# EAGLE design untitled (EAGLE 9.6.2)
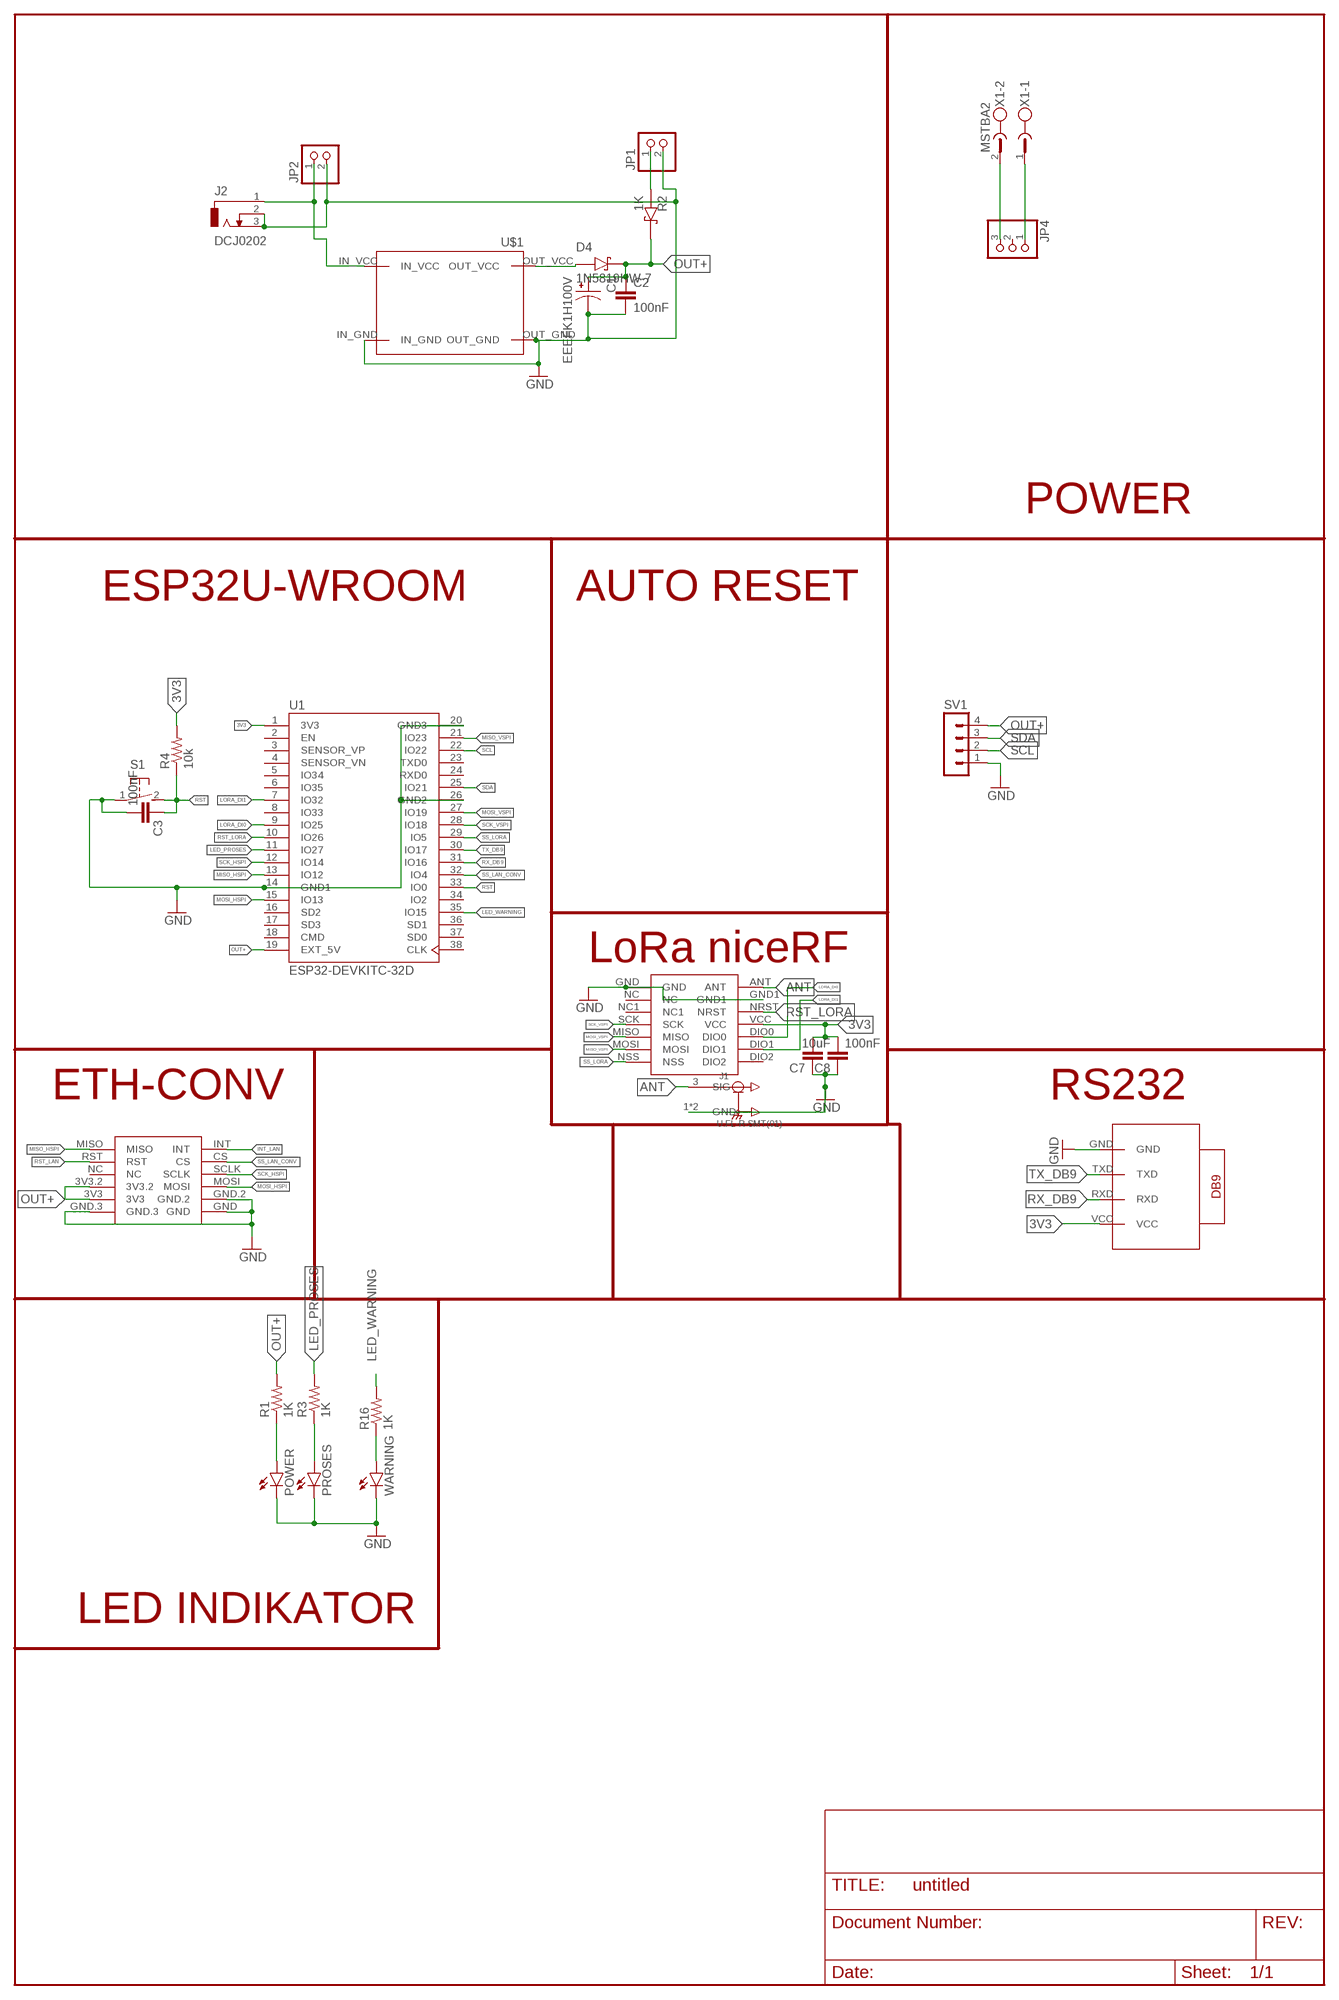
[diagram p0: schematic, sheet 1]

## Parts
C1  EEEFK1H100V  [CAP_EEEFK1H100V]
C2  100nF  C-EUC0805K  [C0805K]
C3  100nF  C-EUC0805K  [C0805K]
C7  10uF  C-EUC0805K  [C0805K]
C8  100nF  C-EUC0805K  [C0805K]
D4  1N5819HW-7  [SOD3715X145N]
J1  U.FL-R-SMT(01)  [HRS_U.FL-R-SMT(01)]
J2  DCJ0202  [DCJ0202]
JP1  PINHD-1X2  [1X02]
JP2  PINHD-1X2  [1X02]
JP4  PINHD-1X3  [1X03]
LORA-NICERF-V1  LORA-NICERF-V2  [LORA-NICERF-V2]
POWER  TLLR4400  [LED3MM]
PROSES  TLLR4400  [LED3MM]
R1  1K  R-US_M0805  [M0805]
R2  1K  1N5819HW-7  [SOD3715X145N]
R3  1K  R-US_M0805  [M0805]
R4  10k  R-US_M0805  [M0805]
R16  1K  R-US_M0805  [M0805]
S1  31-XX  [B3F-31XX]
SV1  MA04-1  [MA04-1]
U1  ESP32-DEVKITC-32D  [MODULE_ESP32-DEVKITC-32D]
U$1  STEPDOWN_SY8205  [STEPDOWN_SY8205]
U$3  MINI_W5500  [MINI_W5500]
U$5  RS232-BREAKOUTBREAKOUT  [RS232-BREAKOUT]
WARNING  TLLR4400  [LED3MM]
X1  MSTBA2  [MSTBA2]

## Nets
3V3: C7.2 C8.2 LORA-NICERF-V1.VCC R4.2 U1.1(3V3) U$5.VCC
ANT: J1.3(SIG) LORA-NICERF-V1.ANT
GND: C1.2 C2.2 C3.2 C7.1 C8.1 J1.1(GND) J1.2(GND) J2.2 J2.3 JP1.2 JP2.2 LORA-NICERF-V1.GND LORA-NICERF-V1.GND1 POWER.K(C) PROSES.K(C) S1.1(P) SV1.1 U1.14(GND1) U1.20(GND3) U1.26(GND2) U$1.IN_GND U$1.OUT_GND U$3.GND U$3.GND.2 U$3.GND.3 U$5.GND WARNING.K(C)
INT_LAN: U$3.INT
LED_PROSES: R3.2 U1.11(IO27)
LED_WARNING: R16.2 U1.35(IO15)
LORA_DI0: LORA-NICERF-V1.DIO0 U1.9(IO25)
LORA_DI1: LORA-NICERF-V1.DIO1 U1.7(IO32)
MISO_HSPI: U1.13(IO12) U$3.MISO
MISO_VSPI: LORA-NICERF-V1.MOSI U1.21(IO23)
MOSI_HSPI: U1.15(IO13) U$3.MOSI
MOSI_VSPI: LORA-NICERF-V1.MISO U1.27(IO19)
N$1: POWER.A R1.1
N$3: PROSES.A R3.1
N$4: J2.1 JP2.1 U$1.IN_VCC
N$5: JP4.3 X1.2
N$6: D4.A U$1.OUT_VCC
N$7: JP1.1 R2.A
N$8: JP4.1 X1.1
N$16: R16.1 WARNING.A
OUT+: C1.1 C2.1 D4.C(K) R1.2 R2.C(K) SV1.4 U1.19(EXT_5V) U$3.3V3 U$3.3V3.2
RST: C3.1 R4.1 S1.2(S) U1.33(IO0)
RST_LAN: U$3.RST
RST_LORA: LORA-NICERF-V1.NRST U1.10(IO26)
RX_DB9: U1.31(IO16) U$5.RXD
SCK_HSPI: U1.12(IO14) U$3.SCLK
SCK_VSPI: LORA-NICERF-V1.SCK U1.28(IO18)
SCL: SV1.2 U1.22(IO22)
SDA: SV1.3 U1.25(IO21)
SS_LAN_CONV: U1.32(IO4) U$3.CS
SS_LORA: LORA-NICERF-V1.NSS U1.29(IO5)
TX_DB9: U1.30(IO17) U$5.TXD
Unconnected: JP4.2 LORA-NICERF-V1.DIO2 LORA-NICERF-V1.NC LORA-NICERF-V1.NC1 U1.2(EN) U1.3(SENSOR_VP) U1.4(SENSOR_VN) U1.5(IO34) U1.6(IO35) U1.8(IO33) U1.16(SD2) U1.17(SD3) U1.18(CMD) U1.23(TXD0) U1.24(RXD0) U1.34(IO2) U1.36(SD1) U1.37(SD0) U1.38(CLK) U$3.NC

## Notes on the sheet
- POWER
- ESP32U-WROOM | AUTO RESET
- LoRa niceRF
- ETH-CONV | RS232
- LED INDIKATOR

## Library data of the parts
C1 = EEEFK1H100V:EEEFK1H100V: Check availability <https://pricing.snapeda.com/parts/EEEFK1H100V/Panasonic/view-part?ref=eda>; AVAILABILITY: In Stock; DESCRIPTION: CAP ALUM 10UF 20% 50V SMD; MF: Panasonic; MP: EEEFK1H100V; PACKAGE: RADIAL-2 Panasonic; PRICE: None; PURCHASE-URL: https://pricing.snapeda.com/search/part/EEEFK1H100V/?ref=eda
C2 C3 C7 C8 = rcl:C-EU: CAPACITOR, European symbol; SPICEPREFIX: C
D4 R2 = 1N5819HW-7:1N5819HW-7: 1N5819HW Series 40 V 1 A Surface Mount Schottky Barrier Rectifier - SOD-123 Check availability <https://pricing.snapeda.com/parts/1N5819HW-7/Diodes%20Inc./view-part?ref=eda>; AVAILABILITY: In Stock; DESCRIPTION: Diode Schottky 40 V 1A Surface Mount SOD-123; MF: Diodes Inc.; MP: 1N5819HW-7; PACKAGE: SOD-123 Fairchild Semiconductor; PRICE: None; PURCHASE-URL: https://pricing.snapeda.com/search/part/1N5819HW-7/?ref=eda
J1 = U.FL-R-SMT_01_:U.FL-R-SMT(01): U.FL Series 6 Ghz 50 Ohm Ultra-small SMT Coaxial Cable Receptacle Check availability <https://pricing.snapeda.com/parts/U.FL-R-SMT%2801%29/Hirose/view-part?ref=eda>; AVAILABILITY: In Stock; DESCRIPTION: U.FL (UMCC) Connector Receptacle, Male Pin 50Ohm Surface Mount Solder. RF Connectors / Coaxial Connectors; MF: Hirose; MP: U.FL-R-SMT(01); PACKAGE: None; PRICE: None; PURCHASE-URL: https://pricing.snapeda.com/search/part/U.FL-R-SMT(01)/?ref=eda
J2 = con-jack:DCJ0202: DC POWER JACK Source: DCJ0202.pdf; OC_FARNELL: unknown; OC_NEWARK: unknown
JP1 JP2 = pinhead:PINHD-1X2: PIN HEADER
JP4 = pinhead:PINHD-1X3: PIN HEADER
LORA-NICERF-V1 = LORA-NICERF-V2:LORA-NICERF-V2
POWER PROSES WARNING = led:TLLR4400: Low Current (2mA) LED 3 mm Tinted Diffused Package color RED Source: Data sheet <http://www.farnell.com/datasheets/391100.pdf>; MF: VISHAY SEMICONDUCTOR; OC_FARNELL: 1612437
R1 R3 R4 R16 = adafruit:R-US_: RESISTOR, American symbol
S1 = switch-omron:31-XX: OMRON SWITCH; MPN: B3F-3100; OC_FARNELL: 959704; OC_NEWARK: 36M3582
SV1 = con-lstb:MA04-1: PIN HEADER; OC_FARNELL: unknown; OC_NEWARK: unknown
U1 = ESP32-DEVKITC-32D:ESP32-DEVKITC-32D: Eval Board For Esp-Wroom-32 Check availability <https://pricing.snapeda.com/parts/ESP32-DEVKITC-32D/Espressif%20Systems/view-part?ref=eda>; AVAILABILITY: In Stock; DESCRIPTION: WiFi Development Tools (802.11) ESP32 General Development Kit, ESP32-WROOM-32D on the board; MF: Espressif Systems; MP: ESP32-DEVKITC-32D; PACKAGE: None; PRICE: None; PURCHASE-URL: https://pricing.snapeda.com/search/part/ESP32-DEVKITC-32D/?ref=eda
U$1 = STEPDOWN_SY8205:STEPDOWN_SY8205
U$3 = ethernet-mikroavr:MINI_W5500: MINI ETHERNET W5500, CREATE BY MIKROAVR.COM
U$5 = RS232-BREAKOUT:RS232-BREAKOUT
X1 = con-phoenix-508:MSTBA2: PHOENIX; MF: FARNELL; MPN: 1757242; OC_FARNELL: 3705171; OC_NEWARK: 71C4161

## Net classes
0 default: clearance 0.1 mm

## Board
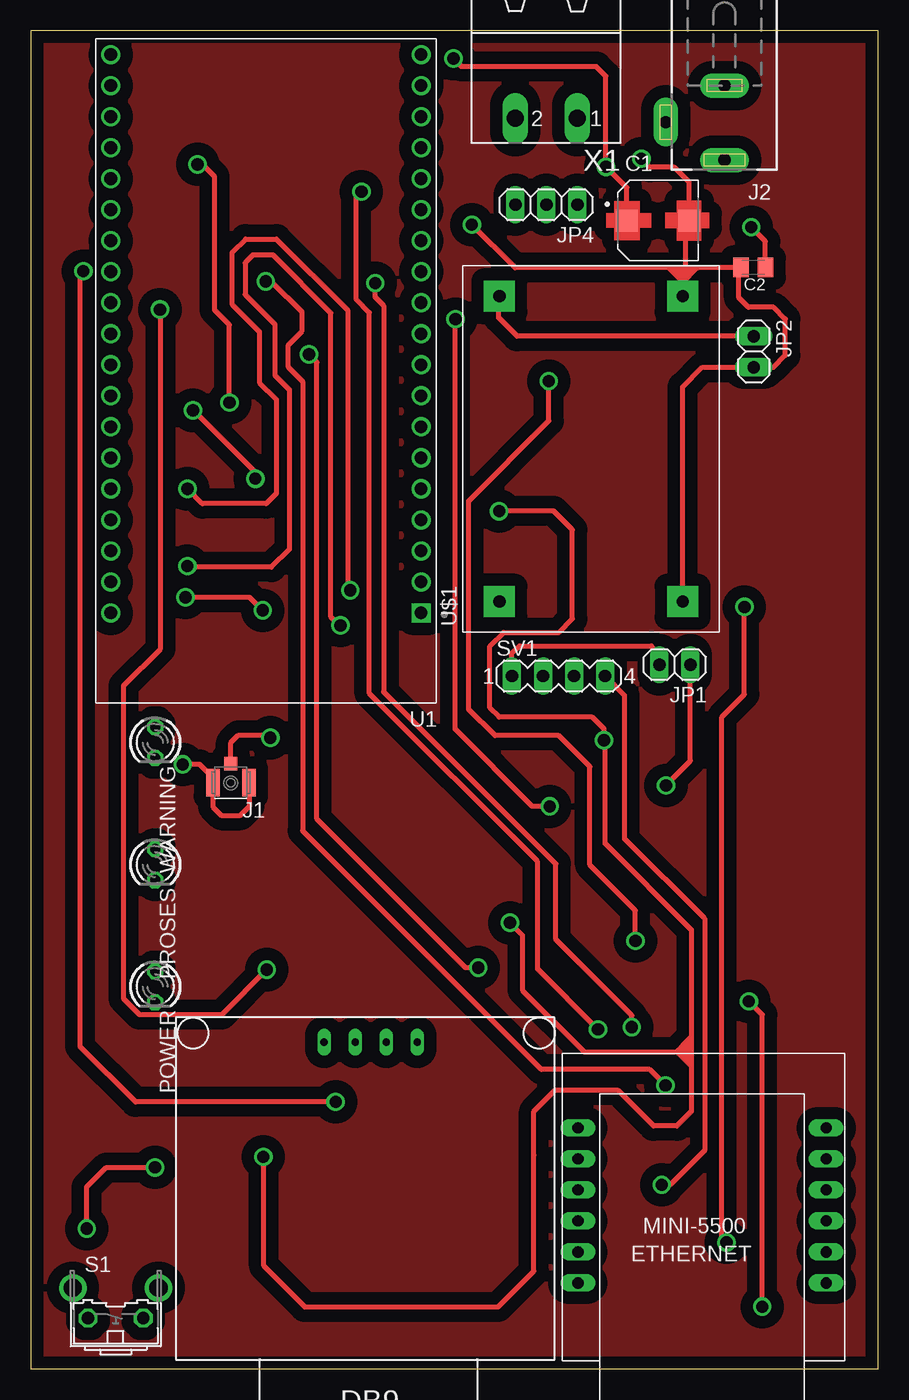
[diagram p1: board, top side]
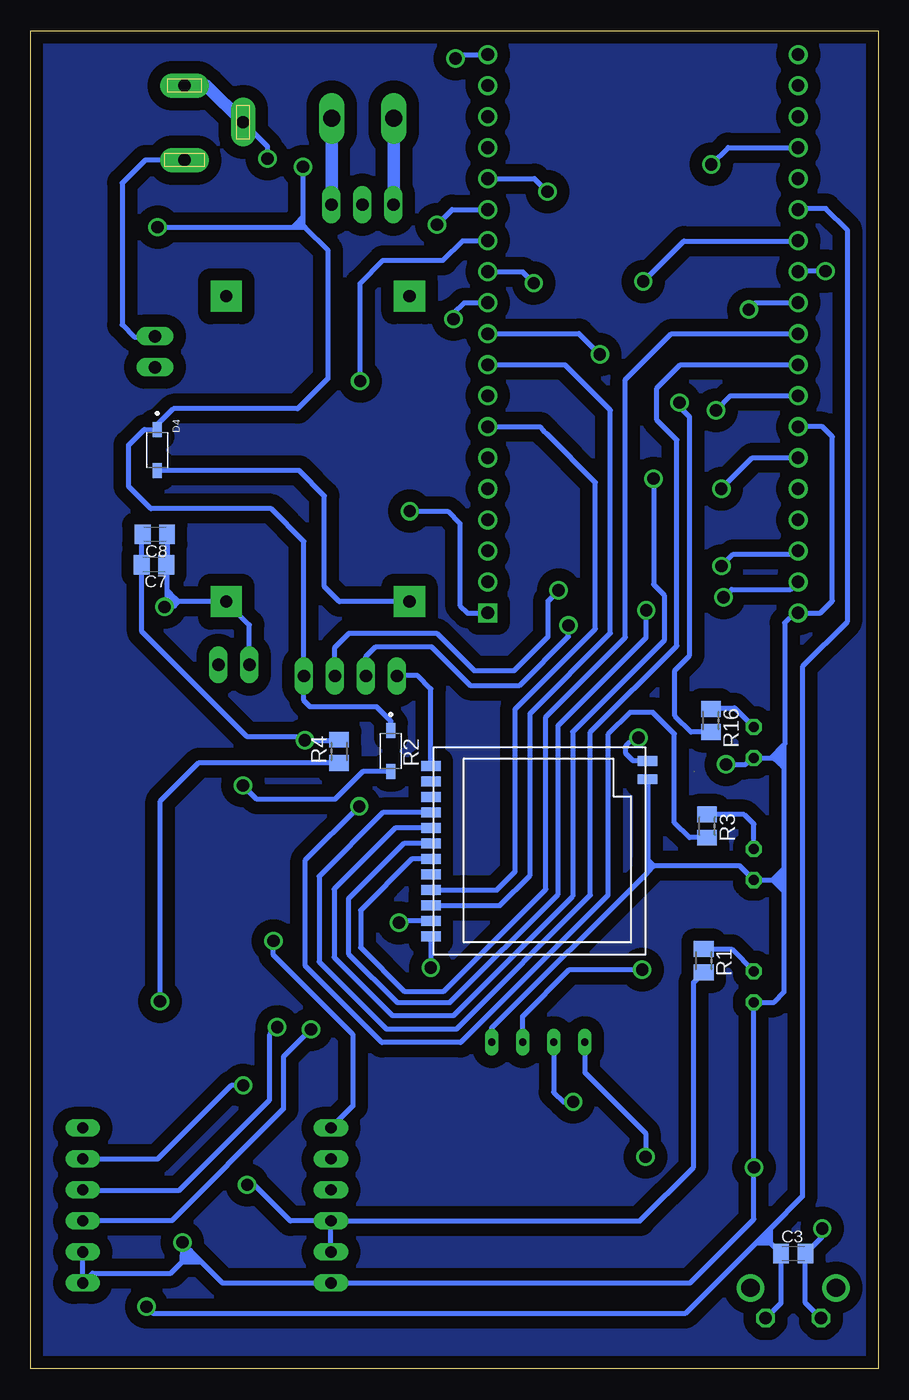
[diagram p2: board, bottom side, seen from below]

Size 69.4 x 109.6 mm. Coordinates in mm from the lower left corner, seen from the top.
Outline: 0,0 69.4,0 69.4,109.6 0,109.6 0,0
Copper layers (1*16): Top 0.035mm / dielectric 1.5mm / Bottom 0.035mm
Design rules "default": minimum track width 6mil, minimum drill 0.35mm, track to track 6mil, track to pad 6mil, pad to pad 6mil, via to via 6mil, smd to smd 6mil, copper to edge 40mil, drill to drill 6mil, minimum pad ring 10mil, minimum via ring 8mil, stop-mask expansion 4mil, vias tented up to drill 0mil, thermal gap 10mil

### Footprints (pad centres in the part's own frame; a part is rotated, then mirrored left to right if it is on the bottom)
CAP_EEEFK1H100V = smd 1.8 x 1.8: 1 -2.55,0; 2 2.55,0
C0805K = smd 1.3 x 1.6: 1 -1,0; 2 1,0
SOD3715X145N = smd 1.21 x 0.73: A 1.68,0; C -1.68,0
HRS_U.FL-R-SMT(01) = smd 1.1 x 2.25: 1 -1.475,0; 2 1.475,0 | smd 1.05 x 1.1: 3 0,-1.55
DCJ0202 = drill 1 pad 2 long: 1 0,3.1; 2 4.8,0; 3 0,-3
1X02 = drill 1.016 long: 1 -1.27,0; 2 1.27,0
1X03 = drill 1.016 long: 1 -2.54,0; 2 0,0; 3 2.54,0
LORA-NICERF-V2 = smd 1.6 x 0.8: ANT 9.17,6.81; DIO0 -8.57,-5.03; DIO1 -8.57,-3.76; DIO2 -8.57,-2.49; GND -8.57,6.4; GND1 9.17,5.31; MISO -8.57,1.32; MOSI -8.57,0.05; NC -8.57,5.13; NC1 -8.57,3.86; NRST -8.57,-7.57; NSS -8.57,-1.22; SCK -8.57,2.59; VCC -8.57,-6.3
LED3MM = drill 0.813 octagon: A -1.27,0; K 1.27,0
M0805 = smd 1.3 x 1.6: 1 -0.95,0; 2 0.95,0
B3F-31XX = drill 1.016 octagon: 1 -2.261,-1.245; 2 2.261,-1.245 | drill 1.499 pad 2.159: 3 -3.505,1.245; 4 3.505,1.245
MA04-1 = drill 1.016 long: 1 -3.81,0; 2 -1.27,0; 3 1.27,0; 4 3.81,0
MODULE_ESP32-DEVKITC-32D = drill 1.04 square: 1 -12.7,19.76 | drill 1.04: 2 -12.7,17.22; 3 -12.7,14.68; 4 -12.7,12.14; 5 -12.7,9.6; 6 -12.7,7.06; 7 -12.7,4.52; 8 -12.7,1.98; 9 -12.7,-0.56; 10 -12.7,-3.1; 11 -12.7,-5.64; 12 -12.7,-8.18; 13 -12.7,-10.72; 14 -12.7,-13.26; 15 -12.7,-15.8; 16 -12.7,-18.34; 17 -12.7,-20.88; 18 -12.7,-23.42; 19 -12.7,-25.96; 20 12.7,19.76; 21 12.7,17.22; 22 12.7,14.68; 23 12.7,12.14; 24 12.7,9.6; 25 12.7,7.06; 26 12.7,4.52; 27 12.7,1.98; 28 12.7,-0.56; 29 12.7,-3.1; 30 12.7,-5.64; 31 12.7,-8.18; 32 12.7,-10.72; 33 12.7,-13.26; 34 12.7,-15.8; 35 12.7,-18.34; 36 12.7,-20.88; 37 12.7,-23.42; 38 12.7,-25.96
STEPDOWN_SY8205 = drill 1 pad 2.54 square: IN_GND 18,-2.5; IN_VCC 3,-2.5; OUT_GND 18,-27.5; OUT_VCC 3,-27.5
MINI_W5500 = drill 0.914 long: 3V3 21.844,-8.89; 3V3.2 21.844,-11.43; CS 1.524,-16.51; GND 1.524,-6.35; GND.2 1.524,-8.89; GND.3 21.844,-6.35; INT 1.524,-19.05; MISO 21.844,-19.05; MOSI 1.524,-11.43; NC 21.844,-13.97; RST 21.844,-16.51; SCLK 1.524,-13.97
RS232-BREAKOUT = drill 0.6 long: GND 11.25,2; RXD 16.33,2; TXD 13.79,2; VCC 18.87,2
MSTBA2 = drill 1.397 long: 1 -2.54,5.08; 2 2.54,5.08

### Placement (x,y rotation side)
C1  51.36,94.04 0 top
C2  59.16,90.19 180 top
C3  6.97,9.45 0 bottom
C7  59.29,65.87 180 bottom
C8  59.23,68.34 180 bottom
D4  59.02,75.25 270 bottom
J1  16.4,48.01 180 top
J2  56.8,102.1 180 top
JP1  52.75,57.68 180 top
JP2  59.2,83.3 270 top
JP4  42.23,95.34 180 top
LORA-NICERF-V1  28.06,42.98 0 bottom
POWER  10.2,31.3 270 top
PROSES  10.2,41.3 270 top
R1  14.29,33.44 270 bottom
R2  39.9,50.6 270 bottom
R3  14.01,44.46 270 bottom
R4  44.15,50.58 90 bottom
R16  13.71,53.11 270 bottom
S1  6.97,5.4 0 top
SV1  43.22,56.74 0 top
U1  19.27,81.67 180 top
U$1  35.38,90.34 0 top
U$3  66.65,0.69 180 top
U$5  42.9,28.77 180 top
WARNING  10.2,51.3 270 top
X1  42.2,107.49 180 top

### Tracks (layer width: path | path; a pad name or v marks a point on that pad's centre or on a via)
3V3  (via drill 1)
  Top 0.406: v39.25,36.54 40.26,35.52 40.26,31.01 45.31,25.97 52.93,25.97 | v19.06,17.37 19.09,17.34 19.09,8.43 22.43,5.08 38.28,5.08 41.2,8 41.2,17.5 41.19,17.51 41.19,21.09 42.9,22.8 48.1,22.8 51,19.9 52.9,19.9 54.1,21.1 54.1,24.8 | v38.36,70.24 38.38,70.26 42.82,70.26 44.36,68.72 44.36,61.42 43.26,60.32 38.73,60.32 37.6,59.19 37.6,54.14 38.36,53.38 45.98,53.38 46.94,52.41 v46.94,51.48 47.01,51.41 47.01,43.05 54.1,35.97 54.1,27.2 | 54.1,27.2 54.1,26.6 | 54.1,26.6 54.1,26.1 | 54.1,26.1 54.1,25.3 | 54.1,25.3 54.1,24.8 | 54.1,24.8 53,25.9 | 53,25.9 52.93,25.97 | 52.93,25.97 52.93,26.03 53.25,26.35 | 53.25,26.35 53.5,26.6 | 53.5,26.6 53.65,26.75 | 53.65,26.75 54.1,27.2 | 53,25.9 53.5,25.9 53.9,25.5 | 53.9,25.5 54.1,25.3 | 53.25,26.35 53.9,25.7 53.9,25.5 | 53.5,26.6 54,26.1 54.1,26.1 | 53.65,26.75 53.95,26.75 54.1,26.6
  Bottom 0.406: C8.2 60.29,68.28 C7.2 60.29,60.38 51.71,51.8 47.26,51.8 v46.94,51.48 44.2,51.48 R4.2 | LORA-NICERF-V1.VCC 39.1,36.68 v39.25,36.54 | U$5.VCC 24.03,24.27 19.06,19.3 v19.06,17.37 | v38.36,70.24 35.27,70.24 34.26,69.24 34.26,62.52 33.63,61.89 31.99,61.89 U1.1
ANT  (via drill 1)
  Top 0.406: J1.3 16.4,51.29 17.01,51.89 19.42,51.89 v19.63,51.69
  Bottom 0.406: LORA-NICERF-V1.ANT 20.07,49.79 20.67,50.39 20.67,51.05 20.03,51.69 v19.63,51.69
GND  (via drill 1)
  Top 0.406: C2.2 57.99,90.19 | 57.99,90.19 54.65,90.19 | 54.65,90.19 54.09,90.19 | 54.09,90.19 53.43,89.53 | 53.43,89.53 53.2,89.3 | 53.2,89.3 53.2,88.02 U$1.IN_GND | 53.2,89.3 53.2,89.78 53.61,90.19 | 57.99,90.19 57.99,87.71 58.76,86.94 60.83,86.94 61.8,85.97 61.8,83 60.82,82.03 JP2.2 54.99,82.03 53.38,80.42 U$1.OUT_GND | U$1.IN_GND 53.38,89.04 52.49,89.93 | 52.49,89.93 52.25,90.17 | 52.25,90.17 39.66,90.17 v36.12,93.7 | SV1.1 39.41,58.61 40.02,59.22 50.82,59.22 51.57,58.46 51.57,57.77 JP1.2 | v56.97,10.36 56.59,10.75 56.59,53.39 58.44,55.24 v58.44,62.4 | 52.25,90.17 54.58,90.17 | 54.58,90.17 54.63,90.17 54.65,90.19 | 52.49,89.93 53.03,89.93 53.43,89.53 | 54.09,90.19 53.61,90.19 | U$1.IN_GND 53.38,88.97 54.58,90.17 | v12.46,49.51 13.84,49.51 14.92,48.43 J1.2 14.92,46.04 15.63,45.34 17.18,45.34 17.94,46.1 17.94,47.95 J1.1 | 53.61,90.19 53.61,93.11 54,93.5 54,93.95 C1.2 53.91,97.19 52.7,98.4 50.7,98.4 v50,99.1 | v4.6,11.5 4.6,14.9 6.2,16.5 v10.18,16.5
  Bottom 0.406: U$3.GND.2 U$3.GND 64.33,7.84 57.91,7.84 56.97,8.79 | 7.71,39.09 7.71,30.86 8.54,30.03 POWER.K 10.18,30.01 v10.18,16.5 10.18,12.27 15.41,7.04 U$3.GND.3 53.69,7.04 55.43,8.79 | 7.71,39.09 7.71,40.37 | 7.71,40.37 7.71,41.97 7.73,41.95 | 8.11,40.57 8.64,40.03 | 8.11,40.57 7.73,40.95 7.73,41.95 | 8.64,40.03 PROSES.K 11.4,41.23 18.34,41.23 18.38,41.19 | C8.1 58.23,65.93 | 58.23,65.93 C7.1 | JP1.2 51.48,60.94 U$1.OUT_GND 57.3,62.84 | U$5.GND 31.65,27.91 18.89,40.68 | 18.89,40.68 18.38,41.19 | 58.23,63.77 58.23,65.93 | 57.55,63.09 58.23,63.77 | 56.97,8.79 56.97,9.06 | 56.97,9.06 56.97,9.35 | 58.23,63.09 58.23,62.61 58.14,62.7 57.43,62.7 | 58.23,63.09 58.23,63.77 | v12.46,49.51 10.86,49.51 10.27,50.1 WARNING.K 8.77,50.03 | 56.39,9.74 56.15,9.5 | 56.15,9.5 55.81,9.16 | 55.81,9.16 55.43,8.79 | 57.3,62.84 57.43,62.7 | 57.3,62.84 57.55,63.09 | 57.55,63.09 58.23,63.09 | 57.43,62.7 57.73,62.4 v58.44,62.4 | 18.38,41.19 18.89,41.7 | LORA-NICERF-V1.GND 36.63,55.69 37.71,56.78 39.38,56.78 SV1.1 | U1.14 34.9,94.93 v36.12,93.7 | U1.26 4.58,77.15 3.77,76.34 3.77,62.89 4.75,61.91 U1.20 6.86,61.91 7.67,61.11 7.67,51.14 7.73,51.08 | 7.73,51.08 7.73,50.53 | 7.73,50.53 7.73,49.96 | 7.73,49.93 7.73,49.21 | 7.73,49.21 7.73,41.95 | 8.77,50.03 7.73,51.08 | 56.97,8.79 55.43,8.79 | 55.81,9.16 55.92,9.06 56.97,9.06 | 56.15,9.5 56.3,9.35 56.97,9.35 | 56.97,9.57 56.97,9.35 | 56.39,9.74 56.55,9.57 56.97,9.57 | 56.39,9.74 56.97,10.32 v56.97,10.36 56.97,9.57 | v50,99.1 50,100.1 J2.2 | S1.1 5.97,5.42 C3.2 4.6,10.82 v4.6,11.5 | LORA-NICERF-V1.GND1 18.89,41.7 | 18.89,41.7 18.89,41.1 | 18.89,41.1 18.89,40.68 | 18.38,41.19 18.8,41.19 18.89,41.1 | 8.64,40.03 8.05,39.44
  Bottom 0.406: 8.05,39.44 7.71,39.09 | 7.71,40.37 8.05,40.03 | 8.05,40.03 8.05,39.44 | 8.11,40.57 8.11,40.08 8.05,40.03 | 8.64,40.03 | 8.64,40.03 8.05,40.03 | 8.77,50.03 8.55,50.03 | 8.55,50.03 8.24,49.73 | 8.24,49.73 8.09,49.57 | 8.09,49.57 7.73,49.21 | 7.73,50.53 8.23,50.03 8.55,50.03 | 7.73,49.96 8.01,49.96 8.24,49.73 | 7.73,49.96 7.73,49.93 | 7.73,49.93 8.09,49.57
  Bottom 1.016: J2.3 55,105.1 J2.2
LED_PROSES  (via drill 1)
  Top 0.406: v42.5,46.07 41.06,46.07 34.75,52.39 34.78,52.42 v34.78,85.97
  Bottom 0.406: R3.2 15.47,43.51 16.69,44.72 16.69,52.01 18.46,53.77 20.32,53.77 22.15,51.94 22.15,38.78 34.2,26.73 40.64,26.73 46.91,32.99 46.91,41.67 v42.5,46.07 | U1.11 33.91,87.31 34.78,86.45 v34.78,85.97
LED_WARNING  (via drill 1)
  Top 0.406: v16.29,79.13 16.29,85.51 15.08,86.71 15.08,97.63 14.07,98.64 v13.67,98.64
  Bottom 0.406: R16.2 15.33,52.15 16.66,53.49 16.66,57.21 15.44,58.43 15.44,77.96 16.29,78.81 v16.29,79.13 | U1.35 12.3,100.01 v13.67,98.64
LORA_DI0
  Bottom 0.406: LORA-NICERF-V1.DIO0 30.99,37.95 28.51,40.43 28.51,53.67 21.93,60.25 21.93,78.51 24.37,80.94 25.35,81.93 25.65,82.23 U1.9
LORA_DI1
  Bottom 0.406: LORA-NICERF-V1.DIO1 31.23,39.22 29.73,40.72 29.73,54.03 23.16,60.6 23.16,72.59 27.14,76.58 27.41,76.85 27.72,77.15 U1.7
MISO_HSPI  (via drill 1)
  Top 0.406: v49.52,35.05 49.52,37.54 45.78,41.28 45.78,49.32 43.24,51.85 38.03,51.85 35.86,54.02 35.86,71.08 42.42,77.64 v42.42,80.89
  Bottom 0.406: U$3.MISO 43.01,21.54 43.01,27.39 49.52,33.9 v49.52,35.05 | U1.13 34.03,92.39 35.64,90.78 40.53,90.78 42.42,88.89 v42.42,80.89
MISO_VSPI  (via drill 1)
  Top 0.406: v19,62.12 17.94,63.18 v12.68,63.18
  Bottom 0.406: LORA-NICERF-V1.MOSI 38.84,43.03 43.38,38.5 43.38,34 39.38,30 35.08,30 26.21,38.87 26.21,52.68 19,59.89 v19,62.12 | v12.68,63.18 12.02,63.84 7.18,63.84 U1.21
MOSI_HSPI  (via drill 1)
  Top 0.406: v46.44,27.82 41.51,32.75 41.51,41.54 27.74,55.31 27.74,86.52 26.64,87.61 26.64,95.96 v27.09,96.41
  Bottom 0.406: U$3.MOSI 65.08,12.17 57.82,12.17 48.7,21.29 48.7,25.56 v46.44,27.82 | U1.15 28.15,97.47 v27.09,96.41
MOSI_VSPI  (via drill 1)
  Top 0.406: v18.4,72.9 18.4,73.45 13.33,78.52 13.32,78.52 v13.29,78.49
  Bottom 0.406: LORA-NICERF-V1.MISO 39.55,44.3 44.54,39.31 44.54,33.7 39.79,28.94 34.77,28.94 25.02,38.7 25.02,52.17 17.54,59.65 17.54,63.37 18.4,64.23 v18.4,72.9 | U1.27 12.09,79.69 v13.29,78.49
N$1
  Bottom 0.406: R1.1 12.02,34.38 POWER.A
N$2
  pour Bottom (isolate 1.016): 0,109.6 69.4,109.6 69.4,0 0,0
N$3
  Bottom 0.406: PROSES.A 10.2,44.61 10.99,45.41 R3.1
N$4
  Top 0.406: JP2.1 39.84,84.57 38.32,86.09 38.32,87.78 U$1.IN_VCC
  Bottom 0.406: J2.1 60,99 61.9,97.1 61.9,85.5 60.9,84.5 59.27,84.5 JP2.1
N$5
  Bottom 1.016: X1.2 39.66,95.37 JP4.3
N$6
  Bottom 0.406: U$1.OUT_VCC 44.11,62.84 45.34,64.06 45.34,71.49 47.42,73.57 D4.A
N$7  (via drill 1)
  Top 0.406: v52.01,47.79 54.02,49.79 JP1.1
  Bottom 0.406: R2.A 42.21,48.92 44.49,46.65 50.87,46.65 v52.01,47.79
N$8
  Bottom 1.016: JP4.1 44.74,95.37 X1.1
N$9
  pour Top (isolate 1.016): 0,109.6 69.4,109.6 69.4,0 0,0
N$16
  Bottom 0.406: R16.1 13.71,54.14 11.77,54.14 WARNING.A
OUT+  (via drill 1)
  Top 0.406: v34.62,107.32 35.29,106.65 46.33,106.65 47.1,105.87 v47.1,98.44 48.81,96.73 C1.1 | SV1.4 48.62,55.16 48.62,43.43 55.18,36.87 55.18,17.89 52.35,15.07 v51.67,15.07 | C2.1 60.16,92.34 v59,93.5
  Bottom 0.406: U$3.3V3 U$3.3V3.2 | U$3.3V3.2 48.13,12.12 51.09,15.07 v51.67,15.07 | U$3.3V3.2 19.52,12.12 15.11,16.53 15.11,31.66 R1.2 | U1.19 34.16,107.63 34.47,107.32 v34.62,107.32 | R2.C 39.9,53.05 41.08,54.22 46.51,54.22 47.03,54.74 SV1.4 47.03,67.76 49.72,70.45 59.55,70.45 61.37,72.26 61.37,75.66 60.09,76.93 D4.C 59.02,77.34 57.72,78.64 47.55,78.64 45.05,81.13 45.05,91.6 46.95,93.5 | v47.1,98.44 47.1,94.3 | 47.1,94.3 47.1,93.65 | 47.1,93.65 46.95,93.5 | v59,93.5 47.9,93.5 | 47.9,93.5 47.6,93.8 | 47.6,93.8 47.1,94.3 | 47.9,93.5 46.95,93.5 | 47.1,93.65 47.45,93.65 47.6,93.8
RST  (via drill 1)
  Top 0.406: v59.9,5.1 59.9,29 v58.8,30.1
  Bottom 0.406: R4.1 52.09,49.63 52.12,49.65 55.63,49.65 58.77,46.51 58.77,30.13 v58.8,30.1 | U1.33 6.47,95.03 4.29,95.03 2.56,93.3 2.56,61.17 6.22,57.51 6.22,14.12 8.82,11.52 | 8.82,11.52 9.27,11.07 | 9.27,11.07 10.04,10.3 | 10.04,10.3 15.81,4.53 59.33,4.53 v59.9,5.1 | S1.2 7.97,5.42 C3.1 8.82,10.3 | 8.82,10.3 8.82,11.1 | 8.82,11.1 8.82,11.52 | 8.82,10.3 9.5,10.3 | 9.5,10.3 10.04,10.3 | 8.82,10.3 9.27,10.75 9.27,11.07 | 8.82,11.1 9.5,10.42 9.5,10.3
RST_LORA  (via drill 1)
  Top 0.406: v22.8,83.07 23.43,82.44 23.43,45.05 35.62,32.86 v36.65,32.86
  Bottom 0.406: v22.8,83.07 24.52,84.8 31.94,84.8 U1.10 | LORA-NICERF-V1.NRST 36.65,35.39 v36.65,32.86
RX_DB9  (via drill 1)
  Top 0.406: v24.97,21.87 8.59,21.87 4.03,26.43 4.03,89.6 v4.33,89.89
  Bottom 0.406: U$5.RXD 26.57,22.67 25.77,21.87 v24.97,21.87 | U1.31 6.53,89.89 v4.33,89.89
SCK_HSPI  (via drill 1)
  Top 0.406: v49.22,27.99 49.22,28.94 43,35.16 43,41.36 28.91,55.45 28.91,87.08 28.21,87.78 v28.21,88.92
  Bottom 0.406: U$3.SCLK 65.11,14.65 57.23,14.65 49.86,22.01 49.86,27.35 v49.22,27.99 | v28.21,88.92 29.14,89.85 U1.12
SCK_VSPI
  Bottom 0.406: LORA-NICERF-V1.SCK 40.55,45.57 45.77,40.35 45.77,33.34 40.28,27.85 34.52,27.85 23.56,38.8 23.56,52.14 16.5,59.2 16.5,76.07 18.13,77.7 18.13,80.31 16.21,82.23 U1.28
SCL  (via drill 1)
  Top 0.406: v25.37,60.89 25.27,60.89 24.58,61.58 24.58,86.47 19.85,91.21 18.18,91.21 17.56,90.58 17.56,87.99 20.01,85.54 20.01,81.38 21.18,80.21 21.18,67.11 19.72,65.65 12.93,65.65 v12.84,65.75
  Bottom 0.406: SV1.2 41.95,58.33 41.13,59.16 36.59,59.16 33.41,55.98 29.36,55.98 25.37,59.97 v25.37,60.89 | v12.84,65.75 11.87,66.72 6.84,66.72 U1.22
SDA  (via drill 1)
  Top 0.406: v26.17,63.76 25.95,63.98 25.95,86.71 20.13,92.53 17.6,92.53 16.52,91.45 16.52,87.15 18.74,84.93 18.74,80.78 20.12,79.4 20.12,71.69 19.29,70.86 14.07,70.86 v12.85,72.07
  Bottom 0.406: SV1.3 44.49,59.09 43.32,60.26 36.16,60.26 33.09,57.19 29.82,57.19 27.03,59.97 27.03,62.9 v26.17,63.76 | U1.25 10.32,74.61 v12.85,72.07
SS_LAN_CONV  (via drill 1)
  Top 0.406: v51.98,23.22 50.68,24.52 41.82,24.52 22.28,44.06 22.28,80.85 21.11,82.03 21.11,83.85 22.24,84.99 22.24,86.53 19.72,89.05 v19.25,89.05
  Bottom 0.406: U$3.CS 59.01,17.2 52.99,23.22 v51.98,23.22 | v19.25,89.05 15.93,92.37 6.59,92.37 U1.32
SS_LORA
  Bottom 0.406: LORA-NICERF-V1.NSS 38.2,41.76 42.39,37.57 42.39,34.5 38.82,30.94 35.56,30.94 27.22,39.28 27.22,53.39 20.7,59.91 20.7,81.02 16.95,84.77 U1.29
TX_DB9  (via drill 1)
  Top 0.406: v10.6,86.75 10.64,86.71 10.64,58.97 7.62,55.95 7.62,30.32 8.93,29.01 15.64,29.01 v19.34,32.7
  Bottom 0.406: U$5.TXD 29.11,28.87 25.28,32.7 v19.34,32.7 | U1.30 10.04,87.31 v10.6,86.75